# Altium schematic sheet Header.SchDoc
size A
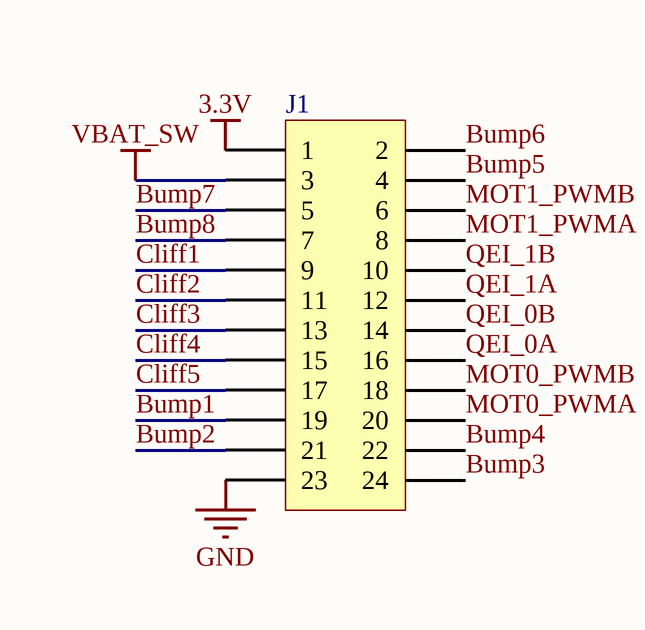
[diagram p0: Header.SchDoc]

## Parts
J1  Header 12X2  [HDR2X12]  (value not drawn)

## Nets
3.3V: J1.1
GND: J1.23
VBAT_SW: J1.3
Bump1: J1.19
Bump2: J1.21
Bump3: J1.24
Bump4: J1.22
Bump5: J1.4
Bump6: J1.2
Bump7: J1.5
Bump8: J1.7
Cliff1: J1.9
Cliff2: J1.11
Cliff3: J1.13
Cliff4: J1.15
Cliff5: J1.17
MOT0_PWMA: J1.20
MOT0_PWMB: J1.18
MOT1_PWMA: J1.8
MOT1_PWMB: J1.6
QEI_0A: J1.16
QEI_0B: J1.14
QEI_1A: J1.12
QEI_1B: J1.10

## Library data of the parts
J1 = Header 12X2: Header, 12-Pin, Dual row; LatestRevisionDate: 17-Jul-2002; LatestRevisionNote: Re-released for DXP Platform.; Publisher: Altium Limited